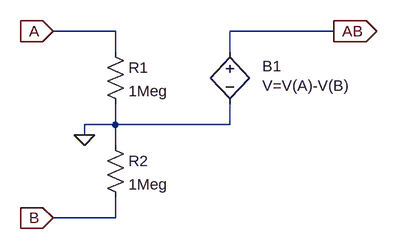
[diagram p0: schematic Subtractor.asc]
Subtractor.asc, the LTspice schematic file:
Version 4.1
SHEET 1 880 680
WIRE 0 32 -96 32
WIRE 336 32 176 32
WIRE 0 64 0 32
WIRE 176 64 176 32
WIRE 0 176 0 144
WIRE 0 176 -48 176
WIRE 176 176 176 144
WIRE 176 176 0 176
WIRE -48 192 -48 176
WIRE 0 208 0 176
WIRE 0 320 0 288
WIRE 0 320 -96 320
FLAG -48 192 0
FLAG -96 32 A
IOPIN -96 32 In
FLAG -96 320 B
IOPIN -96 320 In
FLAG 336 32 AB
IOPIN 336 32 Out
SYMBOL bv 176 48 R0
WINDOW 0 50 38 Left 2
WINDOW 3 50 68 Left 2
SYMATTR InstName B1
SYMATTR Value V=V(A)-V(B)
SYMBOL res -16 48 R0
SYMATTR InstName R1
SYMATTR Value 1Meg
SYMBOL res -16 192 R0
SYMATTR InstName R2
SYMATTR Value 1Meg

The netlist it stands for:
* Subtractor.asc
B1 AB 0 V=V(A)-V(B)
R1 A 0 1Meg
R2 0 B 1Meg
.backanno
.end